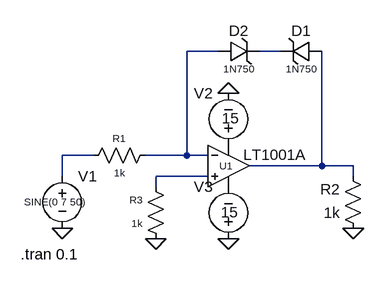
[diagram p0: schematic 6a2.voltage limiter circuit.asc]
6a2.voltage limiter circuit.asc, the LTspice schematic file:
Version 4
SHEET 1 880 680
WIRE 144 64 96 64
WIRE 240 64 208 64
WIRE -48 224 -96 224
WIRE 96 224 96 64
WIRE 96 224 32 224
WIRE 128 224 96 224
WIRE 304 240 304 64
WIRE 304 240 192 240
WIRE 352 240 304 240
WIRE -96 256 -96 224
WIRE 128 256 48 256
WIRE 352 256 352 240
WIRE 48 272 48 256
FLAG 48 352 0
FLAG 352 336 0
FLAG -96 336 0
FLAG 160 128 0
FLAG 160 352 0
SYMBOL OpAmps\\LT1001A 160 176 R0
WINDOW 0 -14 64 Left 1
WINDOW 3 23 47 Left 2
SYMATTR InstName U1
SYMBOL res 48 208 R90
WINDOW 0 0 56 VBottom 1
WINDOW 3 32 56 VTop 1
SYMATTR InstName R1
SYMATTR Value 1k
SYMBOL res 368 352 R180
WINDOW 0 36 76 Left 2
WINDOW 3 36 40 Left 2
SYMATTR InstName R2
SYMATTR Value 1k
SYMBOL res 64 368 R180
WINDOW 0 36 76 Left 1
WINDOW 3 36 40 Left 1
SYMATTR InstName R3
SYMATTR Value 1k
SYMBOL zener 304 48 R90
WINDOW 0 0 32 VBottom 2
WINDOW 3 32 32 VTop 1
SYMATTR InstName D1
SYMATTR Value 1N750
SYMATTR Description Diode
SYMATTR Type diode
SYMBOL zener 144 80 R270
WINDOW 0 32 32 VTop 2
WINDOW 3 0 32 VBottom 1
SYMATTR InstName D2
SYMATTR Value 1N750
SYMATTR Description Diode
SYMATTR Type diode
SYMBOL voltage -96 240 R0
WINDOW 3 -59 55 Left 1
WINDOW 123 0 0 Left 0
WINDOW 39 0 0 Left 0
SYMATTR Value SINE(0 7 50)
SYMATTR InstName V1
SYMBOL voltage 160 224 R180
WINDOW 0 24 96 Left 2
WINDOW 3 -17 57 Left 2
WINDOW 123 0 0 Left 0
WINDOW 39 0 0 Left 0
SYMATTR InstName V2
SYMATTR Value 15
SYMBOL voltage 160 368 R180
WINDOW 0 24 96 Left 2
WINDOW 3 -15 57 Left 2
WINDOW 123 0 0 Left 0
WINDOW 39 0 0 Left 0
SYMATTR InstName V3
SYMATTR Value 15
TEXT -160 376 Left 2 !.tran 0.1

The netlist it stands for:
* 6a2.voltage limiter circuit.asc
XU1 N005 N001 P001 P002 N004 LT1001  ; LT1001A, pins In+ In- V+ V- OUT
R1 N001 N003 1k
R2 0 N004 1k
R3 0 N005 1k
D1 N004 N002 1N750
D2 N001 N002 1N750
V1 N003 0 SINE(0 7 50)
V2 P001 0 15
V3 0 P002 15
.model D D
.lib standard.dio
.tran 0.1
.lib LTC.lib
.backanno
.end